# Altium schematic sheet maseter.SchDoc
size A4
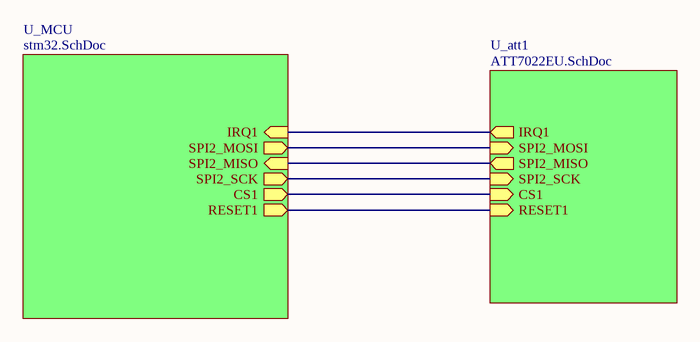
[diagram p0: maseter.SchDoc]

## Sub-sheets
U_att1 = ATT7022EU.SchDoc: IRQ1 (out), SPI2_MOSI (in), SPI2_MISO (out), SPI2_SCK (in), CS1 (in), RESET1 (in)
U_MCU = stm32.SchDoc: SPI2_MOSI (out), SPI2_SCK (out), RESET1 (out), SPI2_MISO (in), IRQ1 (in), CS1 (out)

## Nets
(unnamed): sheet U_MCU/SPI2_MOSI, sheet U_att1/SPI2_MOSI
(unnamed): sheet U_MCU/SPI2_SCK, sheet U_att1/SPI2_SCK
(unnamed): sheet U_MCU/RESET1, sheet U_att1/RESET1
(unnamed): sheet U_MCU/SPI2_MISO, sheet U_att1/SPI2_MISO
(unnamed): sheet U_MCU/IRQ1, sheet U_att1/IRQ1
(unnamed): sheet U_MCU/CS1, sheet U_att1/CS1